# Altium schematic sheet Bridge.SchDoc: Bridge
size A4; CompanyName: TM; DrawnBy: Juan Tinazzo; DocumentNumber: 1; Revision: 1.1; SheetNumber: 3; SheetTotal: 4; SPICEModelCacheWSSKQKTY: <root> / <DocumentId>WSSKQKTY</DocumentId> / <CacheFrame Number="0"> / <Model Name="diode" Kind="MDL"> / <Text>*Default Diode / *Diode Pinout: A,K / .MODEL DIODE D()</Text> / </Model> / <Model Name="zener" Kind="MDL"> / <Text>*ZENER / *Default Zener 10V @ 10mA / *Zener Diode Pinout: A,K / .MODEL ZENER D( BV=10 IBV=10E-3 )</Text> / </Model> / </CacheFrame> / </root>; Number: 25
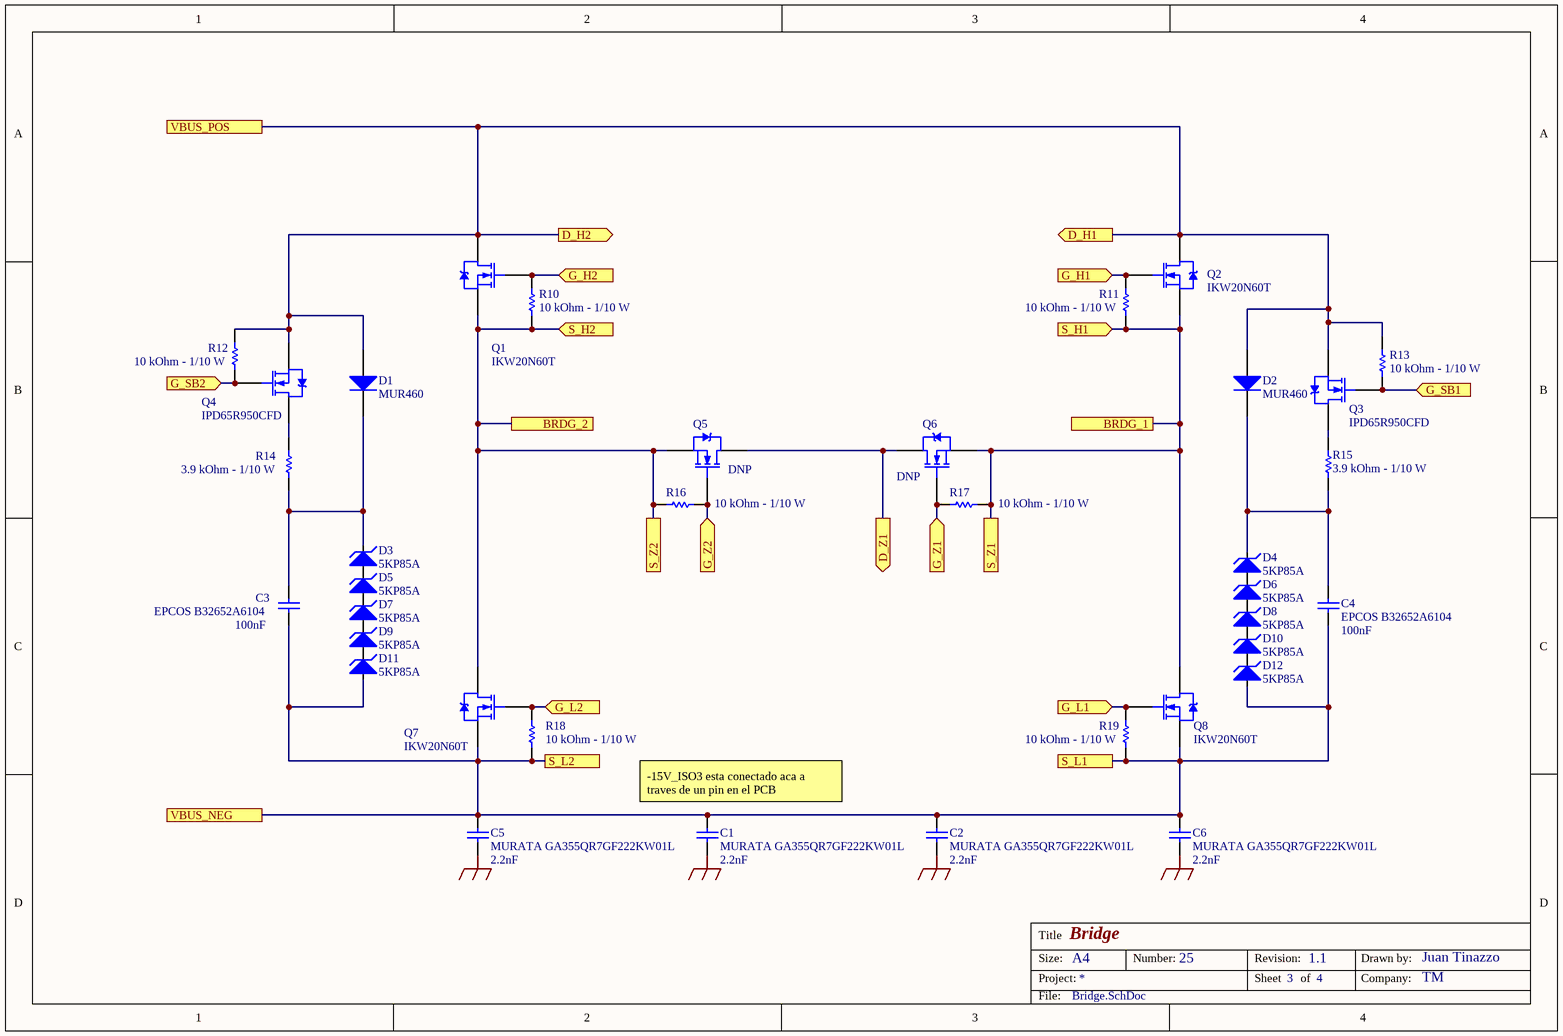
[diagram p0: Bridge.SchDoc]

## Parts
C1  MURATA GA355QR7GF222KW01L  value 2.2nF  [Chip2PinSM127P600-8N_safety]
C2  MURATA GA355QR7GF222KW01L  value 2.2nF  [Chip2PinSM127P600-8N_safety]
C3  EPCOS B32652A6104  value 100nF  [MKP  pitch:15mm size:7mm x 18mm]
C4  EPCOS B32652A6104  value 100nF  [MKP  pitch:15mm size:7mm x 18mm]
C5  MURATA GA355QR7GF222KW01L  value 2.2nF  [Chip2PinSM127P600-8N_safety]
C6  MURATA GA355QR7GF222KW01L  value 2.2nF  [Chip2PinSM127P600-8N_safety]
D1  MUR460  [SMC]
D2  MUR460  [SMC]
D3  5KP85A  [DIODE-0.7]
D4  5KP85A  [DIODE-0.7]
D5  5KP85A  [DIODE-0.7]
D6  5KP85A  [DIODE-0.7]
D7  5KP85A  [DIODE-0.7]
D8  5KP85A  [DIODE-0.7]
D9  5KP85A  [DIODE-0.7]
D10  5KP85A  [DIODE-0.7]
D11  5KP85A  [DIODE-0.7]
D12  5KP85A  [DIODE-0.7]
Q1  IKW20N60T  [TO-247 Horiz. Heatsink]
Q2  IKW20N60T  [TO-247 Horiz. Heatsink]
Q3  IPD65R950CFD  [DPAK229P994X241-3N]
Q4  IPD65R950CFD  [DPAK229P994X241-3N]
Q5  DNP  [TO-247 Horiz. Heatsink]
Q6  DNP  [TO-247 Horiz. Heatsink]
Q7  IKW20N60T  [TO-247 Horiz. Heatsink]
Q8  IKW20N60T  [TO-247 Horiz. Heatsink]
R10  value 10 kOhm - 1/10 W  [RESC1608X50N]  (hidden comment: CRCW060310K0FKEA)
R11  value 10 kOhm - 1/10 W  [RESC1608X50N]  (hidden comment: CRCW060310K0FKEA)
R12  value 10 kOhm - 1/10 W  [RESC1608X50N]  (hidden comment: CRCW060310K0FKEA)
R13  value 10 kOhm - 1/10 W  [RESC1608X50N]  (hidden comment: CRCW060310K0FKEA)
R14  value 3.9 kOhm - 1/10 W  [RESC1608X50N]  (hidden comment: CRCW060310K0FKEA)
R15  value 3.9 kOhm - 1/10 W  [RESC1608X50N]  (hidden comment: CRCW060310K0FKEA)
R16  value 10 kOhm - 1/10 W  [RESC1608X50N]  (hidden comment: CRCW060310K0FKEA)
R17  value 10 kOhm - 1/10 W  [RESC1608X50N]  (hidden comment: CRCW060310K0FKEA)
R18  value 10 kOhm - 1/10 W  [RESC1608X50N]  (hidden comment: CRCW060310K0FKEA)
R19  value 10 kOhm - 1/10 W  [RESC1608X50N]  (hidden comment: CRCW060310K0FKEA)

## Ports
BRDG_1, BRDG_2, D_H1 (out), D_H2 (out), D_Z1 (out), G_H1 (in), G_H2 (in), G_L1 (in), G_L2 (in), G_SB1 (in), G_SB2 (in), G_Z1 (in), G_Z2 (in), S_H1 (in), S_H2 (in), S_L1, S_L2, S_Z1, S_Z2, VBUS_NEG, VBUS_POS

## Nets
EARTH: C1.1 C2.1 C5.1 C6.1
BRDG_1: Q2.3(S) Q6.3(S) Q8.2(D) R11.1 R17.1 ; port BRDG_1, port S_H1, port S_Z1
BRDG_2: Q1.3(S) Q5.3(S) Q7.2(D) R10.1 R16.2 ; port BRDG_2, port S_H2, port S_Z2
D_H1: D1.1(A) D2.1(A) Q1.2(D) Q2.2(D) Q3.3(S) Q4.3(S) R12.1 R13.2 ; port VBUS_POS, port D_H2, port D_H1
D_Z1: Q5.2(D) Q6.2(D) ; port D_Z1
G_H1: Q2.1(G) R11.2 ; port G_H1
G_H2: Q1.1(G) R10.2 ; port G_H2
G_L1: Q8.1(G) R19.2 ; port G_L1
G_L2: Q7.1(G) R18.2 ; port G_L2
G_SB1: Q3.1(G) R13.1 ; port G_SB1
G_SB2: Q4.1(G) R12.2 ; port G_SB2
G_Z1: Q6.1(G) R17.2 ; port G_Z1
G_Z2: Q5.1(G) R16.1 ; port G_Z2
S_L1: C1.2 C2.2 C3.1 C4.1 C5.2 C6.2 D11.1(A) D12.1(A) Q7.3(S) Q8.3(S) R18.1 R19.1 ; port VBUS_NEG, port S_L1, port S_L2
NetC3_2: C3.2 D1.2(K) D3.2(K) R14.2
NetC4_2: C4.2 D2.2(K) D4.2(K) R15.2
NetD3_1: D3.1(A) D5.2(K)
NetD4_1: D4.1(A) D6.2(K)
NetD5_1: D5.1(A) D7.2(K)
NetD6_1: D6.1(A) D8.2(K)
NetD7_1: D7.1(A) D9.2(K)
NetD8_1: D8.1(A) D10.2(K)
NetD9_1: D9.1(A) D11.2(K)
NetD10_1: D10.1(A) D12.2(K)
NetQ3_2: Q3.2(D) R15.1
NetQ4_2: Q4.2(D) R14.1

## Notes on the sheet
- (near C1) -15V_ISO3 esta conectado aca a traves de un pin en el PCB
- Title
- Size:
- Project:
- A4
- Number:
- Revision:
- Sheet
- of
- Drawn by:
- Company:
- File:

## Library data of the parts
C1 C2 C5 C6 = MURATA GA355QR7GF222KW01L: Safety Standard Certified Ceramic Y2 2.2nF 250Vac; Published: 8-Jun-2000; LatestRevisionDate: 17-Jul-2002; LatestRevisionNote: Re-released for DXP Platform.; PackageReference: RAD-0.3; Publisher: Altium Limited; PackageDescription: Radial Cap, Thru-Hole; 2 Leads; 0.3 in Pin Spacing
C3 C4 = EPCOS B32652A6104: MKP High pulse (wound) 100nF 630Vdc; Published: 8-Jun-2000; LatestRevisionDate: 17-Jul-2002; LatestRevisionNote: Re-released for DXP Platform.; PackageReference: RAD-0.3; Publisher: Altium Limited; PackageDescription: Radial Cap, Thru-Hole; 2 Leads; 0.3 in Pin Spacing
D1 D2 = Diode: Default Diode; Published: 8-Jun-2000; LatestRevisionDate: 17-Jul-2002; LatestRevisionNote: Re-released for DXP Platform.; PackageVersion: Sep-1996; PackageReference: SMC; Publisher: Altium Limited; PackageDescription: DO-214-AB/SMC; 2 C-Bend Leads; Body 7.9 x 5.9 mm, inc. leads (LxW); Code_JEDEC: DO-214-AB
D3-D12 = D Zener: Zener Diode; Published: 8-Jun-2000; LatestRevisionDate: 17-Jul-2002; LatestRevisionNote: Re-released for DXP Platform.; PackageReference: DIODE-0.7; Publisher: Altium Limited; PackageDescription: Diode, Thru-Hole; 2 Leads; 0.7 in Pin Spacing
Q1 Q2 Q5-Q8 = IPx65R110CFD: IGBTs LOW LOSS DuoPack 600V 20A; Published: 17-Sep-2003; DatasheetVersion: 13-Jul-2001; PackageVersion: 16-Sep-2002; PackageReference: SMD-0.5; Publisher: Altium Limited; PackageDescription: SM; 3 Leadless Terminals; Body 10.28 x 7.64 x 3.06 mm (LxWxH); ComponentLink1Description: Manufacturer Link; ComponentLink1URL: http://www.irf.com/; ComponentLink2Description: Datasheet; ComponentLink2URL: http://www.irf.com/product-info/datasheets/data/IRHN7150.pdf
Q3 Q4 = IPD65R950CFD: MOSFET N-Ch 700V 3.9A DPAK-2 /; Published: 17-Sep-2003; DatasheetVersion: 13-Jul-2001; PackageVersion: 16-Sep-2002; PackageReference: SMD-0.5; Publisher: Altium Limited; PackageDescription: SM; 3 Leadless Terminals; Body 10.28 x 7.64 x 3.06 mm (LxWxH); ComponentLink1Description: Manufacturer Link; ComponentLink1URL: http://www.irf.com/; ComponentLink2Description: Datasheet; ComponentLink2URL: http://www.irf.com/product-info/datasheets/data/IRHN7150.pdf
R10-R13 R16-R19 = CRCW060310K0FKEA: Resistor; Manufacturer_Name: Vishay; Datasheet Link: http://www.vishay.com/docs/20035/dcrcwe3.pdf; Height: 0.5mm; Manufacturer_Part_Number: CRCW060310K0FKEA; Mouser Part Number: 71-CRCW0603-10K-E3; Mouser Price/Stock: https://www.mouser.co.uk/ProductDetail/Vishay-Dale/CRCW060310K0FKEA?qs=pAO1Z172M84BVnhDjtnsoQ%3D%3D; Arrow Part Number: CRCW060310K0FKEA; Arrow Price/Stock: https://www.arrow.com/en/products/crcw060310k0fkea/vishay?region=nac
R14 R15 = CRCW060310K0FKEA: Resistor; Manufacturer_Name: Vishay; Manufacturer_Part_Number: CRCW06033K90FKEA; Datasheet Link: http://www.vishay.com/docs/20035/dcrcwe3.pdf; Height: 0.5mm; Mouser Part Number: 71-CRCW0603-10K-E3; Mouser Price/Stock: https://www.mouser.co.uk/ProductDetail/Vishay-Dale/CRCW060310K0FKEA?qs=pAO1Z172M84BVnhDjtnsoQ%3D%3D; Arrow Part Number: CRCW060310K0FKEA; Arrow Price/Stock: https://www.arrow.com/en/products/crcw060310k0fkea/vishay?region=nac